# Altium schematic sheet DRV2700.SchDoc
size A4
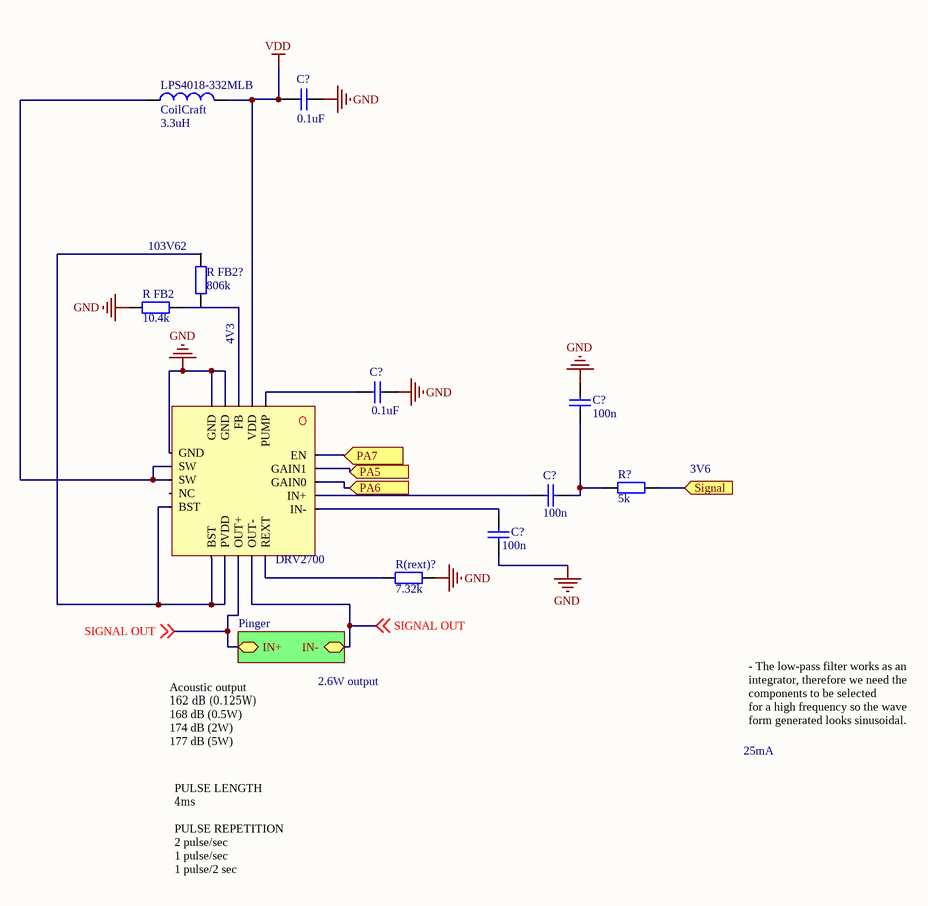
[diagram p0: DRV2700.SchDoc]

## Parts
(Parts that share a designator on the sheet are numbered #1, #2 ... from top to bottom, then left to right.)
*?  DRV2700
C?#1  value 0.1uF  [RAD-0.3]  (hidden comment: +10V rating and X5R or X7R)
C?#2  value 100n  [RAD-0.3]  (hidden comment: Cap)
C?#3  value 0.1uF  [RAD-0.3]  (hidden comment: +10V rating and X5R or X7R)
C?#4  value 100n  [RAD-0.3]  (hidden comment: Cap)
C?#5  value 100n  [RAD-0.3]  (hidden comment: Cap)
LPS4018-332MLB  CoilCraft  value 3.3uH  [0402-A]
R(rext)?  value 7.32k  [AXIAL-0.4]  (hidden comment: Res2)
R?  value 5k  [AXIAL-0.4]  (hidden comment: Res2)
R_FB2  value 10.4k  [AXIAL-0.4]  (hidden comment: Res2)
R_FB2?  value 806k  [AXIAL-0.4]  (hidden comment: Res2)

## Sub-sheets
Designator = Pinger: IN-, IN+

## Ports
PA5 (in), PA6 (in), PA7 (in), Signal (in)

## Nets
GND: *?.4(GND) *?.5(GND) *?.6(GND) C?#1.1 C?#2.1 C?#3.1 C?#5.1 R(rext)?.1 R_FB2.1
VDD: *?.2(VDD) C?#1.2 LPS4018-332MLB.2
PA5: *?.19(GAIN1) ; port PA5
PA6: *?.18(GAIN0) ; port PA6
PA7: *?.20(EN) ; port PA7
Signal: R?.2 ; port Signal
SIGNAL OUT: *?.13(OUT+) *?.14(OUT-) ; off-sheet SIGNAL OUT, sheet Designator/IN-, sheet Designator/IN+
Net*?_1: *?.1(PUMP) C?#3.2
Net*?_3: *?.3(FB) R_FB2.2 R_FB2?.1
Net*?_7: *?.7(SW) *?.8(SW) LPS4018-332MLB.1
Net*?_10: *?.10(BST) *?.11(BST) *?.12(PVDD)
Net*?_15: *?.15(REXT) R(rext)?.2
Net*?_16: *?.16(IN-) C?#5.2
Net*?_17: *?.17(IN+) C?#4.2
NetC?#2_2: C?#2.2 C?#4.1 R?.1

Not connected (* = marked no-connect by the designer): *? 9(NC); R_FB2? 2

## Notes on the sheet
- (near R_FB2?) 103V62
- 4V3
- (near R?) 3V6
- 2.6W output
- 25mA
- Acoustic output
  ​162 dB (0.125W)
  168 dB (0.5W)
  174 dB (2W)
  177 dB (5W)
- - The low-pass filter works as an integrator, therefore we need the components to be selected
  for a high frequency so the wave form generated looks sinusoidal.
- PULSE LENGTH
  ​4ms
  PULSE REPETITION
  2 pulse/sec
  1 pulse/sec
  1 pulse/2 sec

## Library data of the parts
C?#1-C?#5 = Cap: Capacitor; Published: 8-Jun-2000; LatestRevisionDate: 17-Jul-2002; LatestRevisionNote: Re-released for DXP Platform.; PackageReference: RAD-0.3; Publisher: Altium Limited; PackageDescription: Radial Cap, Thru-Hole; 2 Leads; 0.3 in Pin Spacing
LPS4018-332MLB = Inductor: Code_IEC: 1005; Published: 8-Jun-2000; LatestRevisionDate: 29-May-2009; LatestRevisionNote: IPC-7351 Footprint Added.; PackageReference: 0402-A; Publisher: Altium Limited; PackageDescription: Chip Inductor; Code_JEITA: 0402
R(rext)? = Res2: Current-Limiting Control Resistor; Published: 8-Jun-2000; LatestRevisionDate: 17-Jul-2002; LatestRevisionNote: Re-released for DXP Platform.; PackageReference: AXIAL-0.4; Publisher: Altium Limited; PackageDescription: Axial Device, Thru-Hole; 2 Leads; 0.4 in Pin Spacing
R? R_FB2 R_FB2? = Res2: Resistor; Published: 8-Jun-2000; LatestRevisionDate: 17-Jul-2002; LatestRevisionNote: Re-released for DXP Platform.; PackageReference: AXIAL-0.4; Publisher: Altium Limited; PackageDescription: Axial Device, Thru-Hole; 2 Leads; 0.4 in Pin Spacing
*? = DRV2700: Supplier 1: Mouser; Supplier Part Number 1: 595-DRV2700RGPT